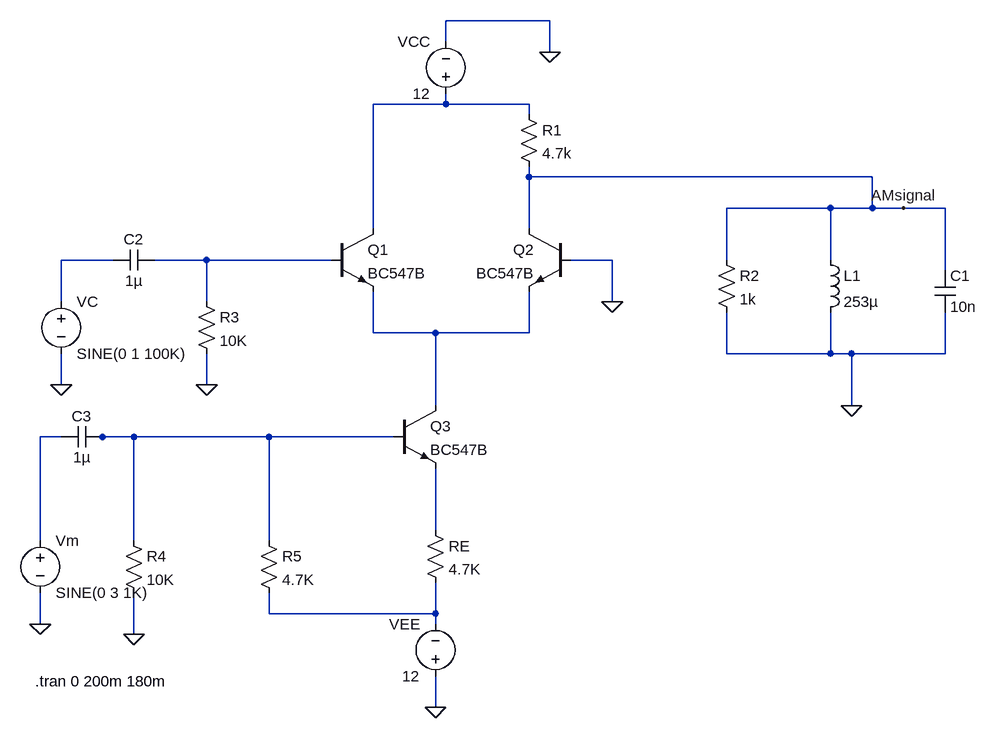
[diagram p0: schematic pce1.asc]
pce1.asc, the LTspice schematic file:
Version 4
SHEET 1 1112 916
WIRE 448 -160 288 -160
WIRE 288 -128 288 -160
WIRE 448 -112 448 -160
WIRE 288 -32 288 -48
WIRE 288 -32 176 -32
WIRE 416 -32 288 -32
WIRE 416 -16 416 -32
WIRE 416 80 416 64
WIRE 944 80 416 80
WIRE 880 128 720 128
WIRE 944 128 944 80
WIRE 944 128 880 128
WIRE 992 128 944 128
WIRE 1056 128 992 128
WIRE 176 160 176 -32
WIRE 416 160 416 80
WIRE -224 208 -304 208
WIRE -80 208 -160 208
WIRE 112 208 -80 208
WIRE 544 208 480 208
WIRE 720 208 720 128
WIRE 880 208 880 128
WIRE 1056 224 1056 128
WIRE -304 272 -304 208
WIRE -80 272 -80 208
WIRE 544 272 544 208
WIRE 176 320 176 256
WIRE 272 320 176 320
WIRE 416 320 416 256
WIRE 416 320 272 320
WIRE 720 352 720 288
WIRE 880 352 880 288
WIRE 880 352 720 352
WIRE 912 352 880 352
WIRE 1056 352 1056 288
WIRE 1056 352 912 352
WIRE -304 400 -304 352
WIRE -80 400 -80 352
WIRE 272 432 272 320
WIRE 912 432 912 352
WIRE -304 480 -336 480
WIRE -240 480 -256 480
WIRE -192 480 -240 480
WIRE 16 480 -192 480
WIRE 208 480 16 480
WIRE 272 624 272 528
WIRE -336 640 -336 480
WIRE -192 640 -192 480
WIRE 16 640 16 480
WIRE 16 752 16 720
WIRE 272 752 272 704
WIRE 272 752 16 752
WIRE -336 768 -336 720
WIRE 272 768 272 752
WIRE -192 784 -192 720
WIRE 272 896 272 848
FLAG -192 784 0
FLAG -304 400 0
FLAG -80 400 0
FLAG 272 896 0
FLAG 448 -112 0
FLAG 544 272 0
FLAG 912 432 0
FLAG -336 768 0
FLAG 992 128 AMsignal
SYMBOL npn 112 160 R0
SYMATTR InstName Q1
SYMATTR Value BC547B
SYMBOL npn 480 160 M0
SYMATTR InstName Q2
SYMATTR Value BC547B
SYMBOL voltage 288 -32 R180
WINDOW 0 24 96 Left 2
WINDOW 3 24 16 Left 2
SYMATTR InstName VCC
SYMATTR Value 12
SYMBOL res 400 -32 R0
SYMATTR InstName R1
SYMATTR Value 4.7k
SYMBOL res 704 192 R0
SYMATTR InstName R2
SYMATTR Value 1k
SYMBOL voltage -304 256 R0
WINDOW 123 0 0 Left 0
WINDOW 39 0 0 Left 0
SYMATTR InstName VC
SYMATTR Value SINE(0 1 100K)
SYMBOL res -96 256 R0
SYMATTR InstName R3
SYMATTR Value 10K
SYMBOL res -208 624 R0
SYMATTR InstName R4
SYMATTR Value 10K
SYMBOL res 0 624 R0
SYMATTR InstName R5
SYMATTR Value 4.7K
SYMBOL res 256 608 R0
SYMATTR InstName RE
SYMATTR Value 4.7K
SYMBOL voltage 272 864 R180
WINDOW 0 24 96 Left 2
WINDOW 3 24 16 Left 2
SYMATTR InstName VEE
SYMATTR Value 12
SYMBOL npn 208 432 R0
SYMATTR InstName Q3
SYMATTR Value BC547B
SYMBOL ind 864 192 R0
SYMATTR InstName L1
SYMATTR Value 253µ
SYMBOL cap 1040 224 R0
SYMATTR InstName C1
SYMATTR Value 10n
SYMBOL cap -160 192 R90
WINDOW 0 0 32 VBottom 2
WINDOW 3 32 32 VTop 2
SYMATTR InstName C2
SYMATTR Value 1µ
SYMBOL voltage -336 624 R0
WINDOW 123 0 0 Left 0
WINDOW 39 0 0 Left 0
SYMATTR InstName Vm
SYMATTR Value SINE(0 3 1K)
SYMBOL cap -240 464 R90
WINDOW 0 0 32 VBottom 2
WINDOW 3 32 32 VTop 2
SYMATTR InstName C3
SYMATTR Value 1µ
TEXT -344 856 Left 2 !.tran 0 200m 180m

The netlist it stands for:
* pce1.asc
Q1 N001 N003 N004 0 BC547B
Q2 AMsignal 0 N004 0 BC547B
VCC N001 0 12
R1 N001 AMsignal 4.7k
R2 AMsignal 0 1k
VC N002 0 SINE(0 1 100K)
R3 N003 0 10K
R4 N006 0 10K
R5 N006 N008 4.7K
RE N007 N008 4.7K
VEE 0 N008 12
Q3 N004 N006 N007 0 BC547B
L1 AMsignal 0 253µ
C1 AMsignal 0 10n
C2 N003 N002 1µ
Vm N005 0 SINE(0 3 1K)
C3 N006 N005 1µ
.model NPN NPN
.model PNP PNP
.lib standard.bjt
.tran 0 200m 180m
.backanno
.end